# Altium schematic sheet LED_Driver_and_LEDs_01.SchDoc
size A
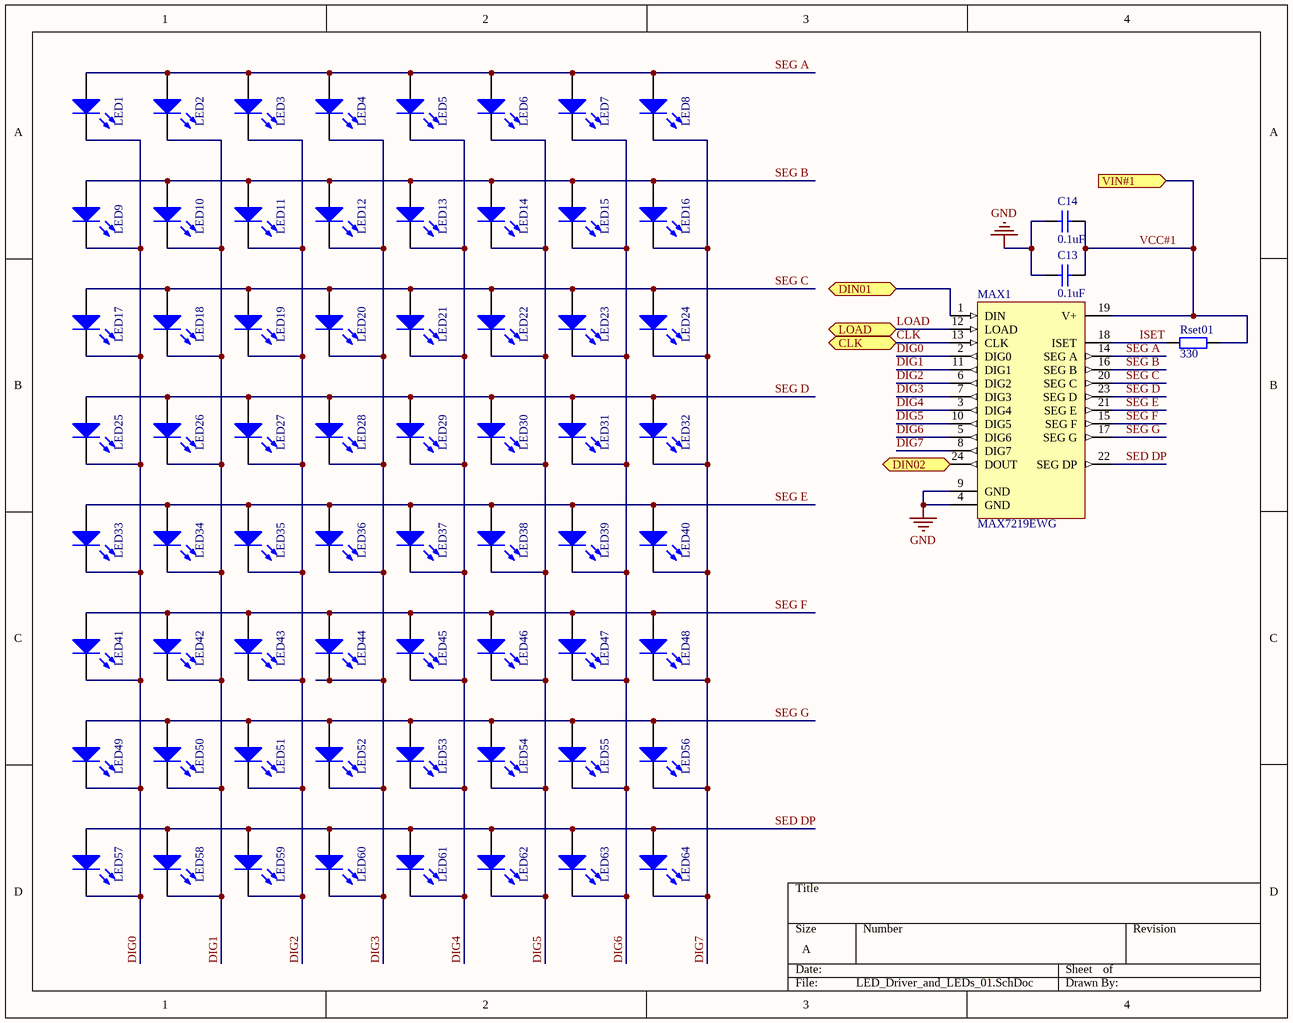
[diagram p0: LED_Driver_and_LEDs_01.SchDoc]

## Parts
C13  value 0.1uF  [6-0805_N]  (hidden comment: Cap Semi)
C14  value 0.1uF  [6-0805_N]  (hidden comment: Cap Semi)
LED1  LED3  [3.5X2.8X1.9]  (value not drawn)
LED2  LED3  [3.5X2.8X1.9]  (value not drawn)
LED3  LED3  [3.5X2.8X1.9]  (value not drawn)
LED4  LED3  [3.5X2.8X1.9]  (value not drawn)
LED5  LED3  [3.5X2.8X1.9]  (value not drawn)
LED6  LED3  [3.5X2.8X1.9]  (value not drawn)
LED7  LED3  [3.5X2.8X1.9]  (value not drawn)
LED8  LED3  [3.5X2.8X1.9]  (value not drawn)
LED9  LED3  [3.5X2.8X1.9]  (value not drawn)
LED10  LED3  [3.5X2.8X1.9]  (value not drawn)
LED11  LED3  [3.5X2.8X1.9]  (value not drawn)
LED12  LED3  [3.5X2.8X1.9]  (value not drawn)
LED13  LED3  [3.5X2.8X1.9]  (value not drawn)
LED14  LED3  [3.5X2.8X1.9]  (value not drawn)
LED15  LED3  [3.5X2.8X1.9]  (value not drawn)
LED16  LED3  [3.5X2.8X1.9]  (value not drawn)
LED17  LED3  [3.5X2.8X1.9]  (value not drawn)
LED18  LED3  [3.5X2.8X1.9]  (value not drawn)
LED19  LED3  [3.5X2.8X1.9]  (value not drawn)
LED20  LED3  [3.5X2.8X1.9]  (value not drawn)
LED21  LED3  [3.5X2.8X1.9]  (value not drawn)
LED22  LED3  [3.5X2.8X1.9]  (value not drawn)
LED23  LED3  [3.5X2.8X1.9]  (value not drawn)
LED24  LED3  [3.5X2.8X1.9]  (value not drawn)
LED25  LED3  [3.5X2.8X1.9]  (value not drawn)
LED26  LED3  [3.5X2.8X1.9]  (value not drawn)
LED27  LED3  [3.5X2.8X1.9]  (value not drawn)
LED28  LED3  [3.5X2.8X1.9]  (value not drawn)
LED29  LED3  [3.5X2.8X1.9]  (value not drawn)
LED30  LED3  [3.5X2.8X1.9]  (value not drawn)
LED31  LED3  [3.5X2.8X1.9]  (value not drawn)
LED32  LED3  [3.5X2.8X1.9]  (value not drawn)
LED33  LED3  [3.5X2.8X1.9]  (value not drawn)
LED34  LED3  [3.5X2.8X1.9]  (value not drawn)
LED35  LED3  [3.5X2.8X1.9]  (value not drawn)
LED36  LED3  [3.5X2.8X1.9]  (value not drawn)
LED37  LED3  [3.5X2.8X1.9]  (value not drawn)
LED38  LED3  [3.5X2.8X1.9]  (value not drawn)
LED39  LED3  [3.5X2.8X1.9]  (value not drawn)
LED40  LED3  [3.5X2.8X1.9]  (value not drawn)
LED41  LED3  [3.5X2.8X1.9]  (value not drawn)
LED42  LED3  [3.5X2.8X1.9]  (value not drawn)
LED43  LED3  [3.5X2.8X1.9]  (value not drawn)
LED44  LED3  [3.5X2.8X1.9]  (value not drawn)
LED45  LED3  [3.5X2.8X1.9]  (value not drawn)
LED46  LED3  [3.5X2.8X1.9]  (value not drawn)
LED47  LED3  [3.5X2.8X1.9]  (value not drawn)
LED48  LED3  [3.5X2.8X1.9]  (value not drawn)
LED49  LED3  [3.5X2.8X1.9]  (value not drawn)
LED50  LED3  [3.5X2.8X1.9]  (value not drawn)
LED51  LED3  [3.5X2.8X1.9]  (value not drawn)
LED52  LED3  [3.5X2.8X1.9]  (value not drawn)
LED53  LED3  [3.5X2.8X1.9]  (value not drawn)
LED54  LED3  [3.5X2.8X1.9]  (value not drawn)
LED55  LED3  [3.5X2.8X1.9]  (value not drawn)
LED56  LED3  [3.5X2.8X1.9]  (value not drawn)
LED57  LED3  [3.5X2.8X1.9]  (value not drawn)
LED58  LED3  [3.5X2.8X1.9]  (value not drawn)
LED59  LED3  [3.5X2.8X1.9]  (value not drawn)
LED60  LED3  [3.5X2.8X1.9]  (value not drawn)
LED61  LED3  [3.5X2.8X1.9]  (value not drawn)
LED62  LED3  [3.5X2.8X1.9]  (value not drawn)
LED63  LED3  [3.5X2.8X1.9]  (value not drawn)
LED64  LED3  [3.5X2.8X1.9]  (value not drawn)
MAX1  MAX7219EWG  [WSO24_N]
Rset01  value 330  [J1-0603]  (hidden comment: Res2)

## Ports
CLK (bidir), DIN01 (bidir), DIN02 (out), LOAD (bidir), VIN#1 (in)

## Nets
GND: C13.2 C14.2 MAX1.4(GND) MAX1.9(GND)
CLK: MAX1.13(CLK) ; port CLK
DIG0: LED1.2(K) LED9.2(K) LED17.2(K) LED25.2(K) LED33.2(K) LED41.2(K) LED49.2(K) LED57.2(K) MAX1.2(DIG0)
DIG1: LED2.2(K) LED10.2(K) LED18.2(K) LED26.2(K) LED34.2(K) LED42.2(K) LED50.2(K) LED58.2(K) MAX1.11(DIG1)
DIG2: LED3.2(K) LED11.2(K) LED19.2(K) LED27.2(K) LED35.2(K) LED43.2(K) LED51.2(K) LED59.2(K) MAX1.6(DIG2)
DIG3: LED4.2(K) LED12.2(K) LED20.2(K) LED28.2(K) LED36.2(K) LED44.2(K) LED52.2(K) LED60.2(K) MAX1.7(DIG3)
DIG4: LED5.2(K) LED13.2(K) LED21.2(K) LED29.2(K) LED37.2(K) LED45.2(K) LED53.2(K) LED61.2(K) MAX1.3(DIG4)
DIG5: LED6.2(K) LED14.2(K) LED22.2(K) LED30.2(K) LED38.2(K) LED46.2(K) LED54.2(K) LED62.2(K) MAX1.10(DIG5)
DIG6: LED7.2(K) LED15.2(K) LED23.2(K) LED31.2(K) LED39.2(K) LED47.2(K) LED55.2(K) LED63.2(K) MAX1.5(DIG6)
DIG7: LED8.2(K) LED16.2(K) LED24.2(K) LED32.2(K) LED40.2(K) LED48.2(K) LED56.2(K) LED64.2(K) MAX1.8(DIG7)
DIN01: MAX1.1(DIN) ; port DIN01
DIN02: MAX1.24(DOUT) ; port DIN02
ISET: MAX1.18(ISET) Rset01.2
LOAD: MAX1.12(LOAD) ; port LOAD
SED DP: LED57.1(A) LED58.1(A) LED59.1(A) LED60.1(A) LED61.1(A) LED62.1(A) LED63.1(A) LED64.1(A) MAX1.22(SEG_DP)
SEG A: LED1.1(A) LED2.1(A) LED3.1(A) LED4.1(A) LED5.1(A) LED6.1(A) LED7.1(A) LED8.1(A) MAX1.14(SEG_A)
SEG B: LED9.1(A) LED10.1(A) LED11.1(A) LED12.1(A) LED13.1(A) LED14.1(A) LED15.1(A) LED16.1(A) MAX1.16(SEG_B)
SEG C: LED17.1(A) LED18.1(A) LED19.1(A) LED20.1(A) LED21.1(A) LED22.1(A) LED23.1(A) LED24.1(A) MAX1.20(SEG_C)
SEG D: LED25.1(A) LED26.1(A) LED27.1(A) LED28.1(A) LED29.1(A) LED30.1(A) LED31.1(A) LED32.1(A) MAX1.23(SEG_D)
SEG E: LED33.1(A) LED34.1(A) LED35.1(A) LED36.1(A) LED37.1(A) LED38.1(A) LED39.1(A) LED40.1(A) MAX1.21(SEG_E)
SEG F: LED41.1(A) LED42.1(A) LED43.1(A) LED44.1(A) LED45.1(A) LED46.1(A) LED47.1(A) LED48.1(A) MAX1.15(SEG_F)
SEG G: LED49.1(A) LED50.1(A) LED51.1(A) LED52.1(A) LED53.1(A) LED54.1(A) LED55.1(A) LED56.1(A) MAX1.17(SEG_G)
VCC#1: C13.1 C14.1 MAX1.19(V+) Rset01.1 ; port VIN#1

## Library data of the parts
C13 C14 = Cap Semi: Capacitor (Semiconductor SIM Model); Published: 8-Jun-2000; LatestRevisionDate: 29-May-2009; LatestRevisionNote: IPC-7351 Footprint Added.; PackageReference: C1206; Publisher: Altium Limited; PackageDescription: Chip Capacitor
LED1-LED64 = LED3: Typical BLUE SiC LED; Published: 8-Jun-2000; LatestRevisionDate: 17-Dec-2003; LatestRevisionNote: PCB Footprint replaced.; DatasheetVersion: 16-Apr-2002; PackageVersion: 16-Apr-2002; PackageReference: 3.5X2.8X1.9; Publisher: Altium Limited; PackageDescription: SM LED; 2 C-Bend Leads; Body 3.5 x 2.8 x 1.9 mm, inc leads (LxWxH typ)
MAX1 = MAX7219EWG: Serially Interfaced, 8-Digit LED Display Driver; Published: 16-Jan-2001; LatestRevisionDate: 13-Apr-2006; LatestRevisionNote: IPC-7351 Footprint Added.; DatasheetVersion: Jul-1997; PackageReference: WSO24; Publisher: Altium Limited; PackageDescription: 24-Pin Small Outline Integrated Circuit 1.27 mm Pitch; ComponentLink1Description: Manufacturer Link; ComponentLink1URL: http://www.maxim-ic.com/; ComponentLink2Description: Datasheet; ComponentLink2URL: http://pdfserv.maxim-ic.com/en/ds/MAX7219-MAX7221.pdf
Rset01 = Res2: Resistor; Published: 8-Jun-2000; LatestRevisionDate: 17-Jul-2002; LatestRevisionNote: Re-released for DXP Platform.; PackageReference: AXIAL-0.4; Publisher: Altium Limited; PackageDescription: Axial Device, Thru-Hole; 2 Leads; 0.4 in Pin Spacing